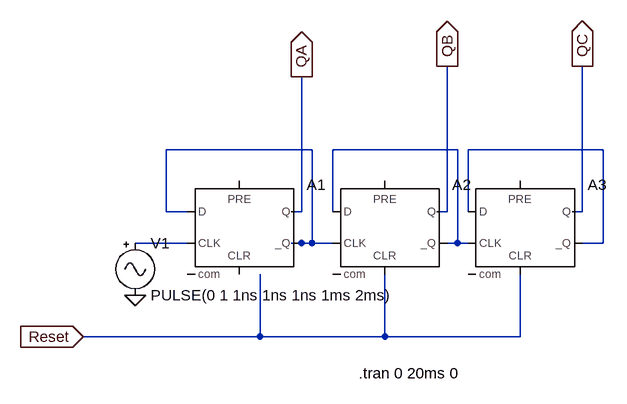
[diagram p0: schematic 3bc.asc]
3bc.asc, the LTspice schematic file:
Version 4.1
SHEET 1 880 680
WIRE 208 -16 -16 -16
WIRE 432 -16 240 -16
WIRE 656 -16 448 -16
WIRE -16 80 -16 -16
WIRE 16 80 -16 80
WIRE 192 80 192 -128
WIRE 192 80 176 80
WIRE 240 80 240 -16
WIRE 416 80 416 -144
WIRE 416 80 400 80
WIRE 448 80 448 -16
WIRE 624 80 624 -144
WIRE 624 80 608 80
WIRE 16 128 -64 128
WIRE 192 128 176 128
WIRE 208 128 208 -16
WIRE 208 128 192 128
WIRE 240 128 208 128
WIRE 432 128 432 -16
WIRE 432 128 416 128
WIRE 448 128 432 128
WIRE 656 128 656 -16
WIRE 656 128 624 128
WIRE 128 272 128 176
WIRE 128 272 -144 272
WIRE 320 272 320 176
WIRE 320 272 128 272
WIRE 528 272 528 176
WIRE 528 272 320 272
FLAG 416 -144 QB
IOPIN 416 -144 Out
FLAG 624 -144 QC
IOPIN 624 -144 Out
FLAG -64 208 0
FLAG 192 -128 QA
IOPIN 192 -128 Out
FLAG -144 272 Reset
IOPIN -144 272 In
SYMBOL Digital\\dflop 320 32 R0
SYMATTR InstName A2
SYMBOL Digital\\dflop 528 32 R0
SYMATTR InstName A3
SYMBOL Misc\\signal -64 112 R0
WINDOW 123 0 0 Left 0
WINDOW 39 0 0 Left 0
SYMATTR InstName V1
SYMATTR Value PULSE(0 1 1ns 1ns 1ns 1ms 2ms)
SYMBOL Digital\\dflop 96 32 R0
SYMATTR InstName A1
TEXT 280 328 Left 2 !.tran 0 20ms 0

The netlist it stands for:
* 3bc.asc
A2 N002 0 N001 0 Reset N002 QB 0 DFLOP
A3 N003 0 N002 0 Reset N003 QC 0 DFLOP
V1 N004 0 PULSE(0 1 1ns 1ns 1ns 1ms 2ms)
A1 N001 0 N004 0 0 N001 QA 0 DFLOP
.tran 0 20ms 0
.backanno
.end